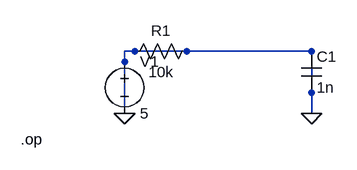
[diagram p0: schematic rc-circuit.asc]
rc-circuit.asc, the LTspice schematic file:
Version 4
SHEET 1 880 680
WIRE 240 160 96 160
WIRE 384 160 240 160
WIRE 384 256 384 160
WIRE 96 256 96 160
FLAG 96 256 0
FLAG 384 256 0
SYMBOL res 208 144 R90
WINDOW 0 0 56 VBottom 2
WINDOW 3 32 56 VTop 2
SYMATTR InstName R1
SYMATTR Value 10k
SYMBOL cap 368 160 R0
WINDOW 0 24 8 Left 2
WINDOW 3 24 56 Left 2
SYMATTR InstName C1
SYMATTR Value 1n
SYMBOL voltage 96 160 R0
WINDOW 123 0 0 Left 2
WINDOW 39 0 0 Left 2
SYMATTR InstName V1
SYMATTR Value 5
TEXT -64 296 Left 2 !.op

The netlist it stands for:
* rc-circuit.asc
R1 0 0 10k
C1 0 0 1n
V1 0 0 5
.op
.backanno
.end